# EAGLE design spin_pov_LDO (EAGLE 9.6.2)
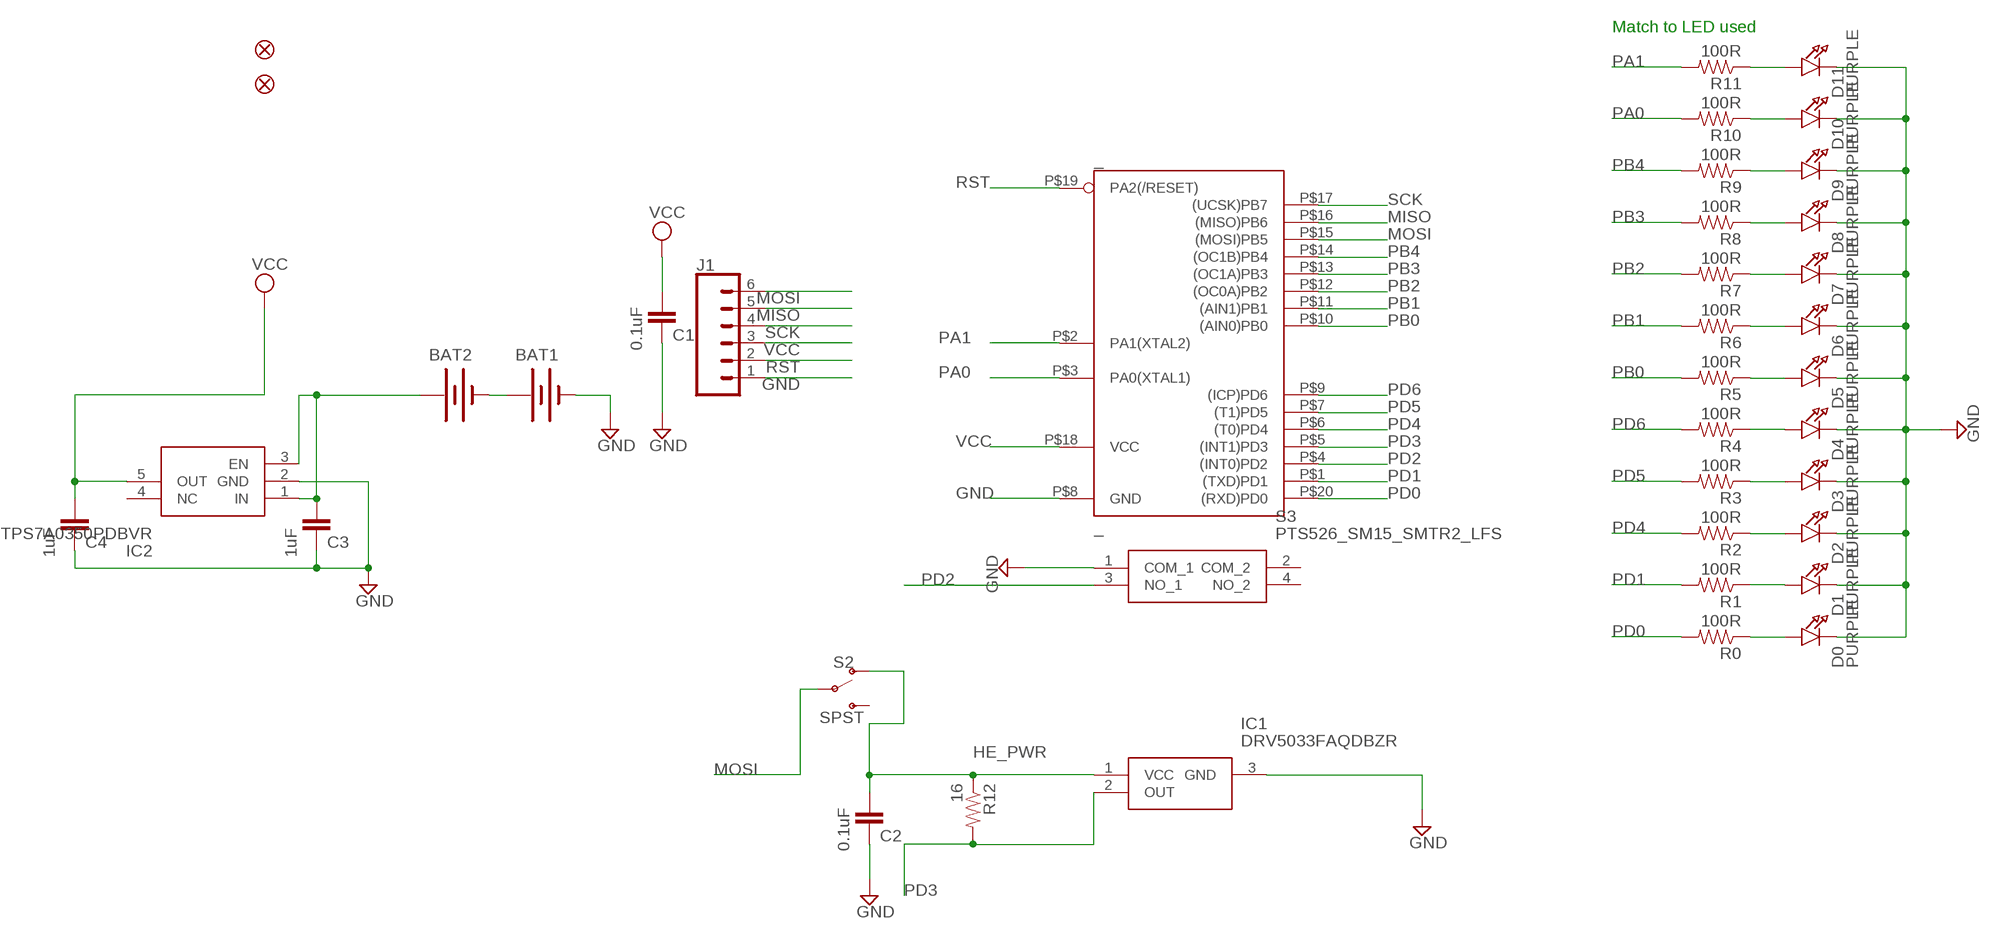
[diagram p0: schematic, sheet 1]

## Parts
_  _  TINY2313-*M*  [MLF20]
AFID1  FIDUCIAL""  [FIDUCIAL_1MM]
AFID2  FIDUCIAL""  [FIDUCIAL_1MM]
BAT1  SPARKFUN_BATTERYSPARKFUN_BATTCOMM_20MM_LINX  [SPARKFUN_BATTCOM_20MM_LINX]
BAT2  SPARKFUN_BATTERYSPARKFUN_BATTCOMM_20MM_LINX  [SPARKFUN_BATTCOM_20MM_LINX]
C1  0.1uF  CAP0805  [0805]
C2  0.1uF  CAP0805  [0805]
C3  1uF  CAP0805  [0805]
C4  1uF  CAP0805  [0805]
D0  PURPLE  LED0805_NOOUTLINE  [CHIPLED_0805_NOOUTLINE]
D1  PURPLE  LED0805_NOOUTLINE  [CHIPLED_0805_NOOUTLINE]
D2  PURPLE  LED0805_NOOUTLINE  [CHIPLED_0805_NOOUTLINE]
D3  PURPLE  LED0805_NOOUTLINE  [CHIPLED_0805_NOOUTLINE]
D4  PURPLE  LED0805_NOOUTLINE  [CHIPLED_0805_NOOUTLINE]
D5  PURPLE  LED0805_NOOUTLINE  [CHIPLED_0805_NOOUTLINE]
D6  PURPLE  LED0805_NOOUTLINE  [CHIPLED_0805_NOOUTLINE]
D7  PURPLE  LED0805_NOOUTLINE  [CHIPLED_0805_NOOUTLINE]
D8  PURPLE  LED0805_NOOUTLINE  [CHIPLED_0805_NOOUTLINE]
D9  PURPLE  LED0805_NOOUTLINE  [CHIPLED_0805_NOOUTLINE]
D10  PURPLE  LED0805_NOOUTLINE  [CHIPLED_0805_NOOUTLINE]
D11  PURPLE  LED0805_NOOUTLINE  [CHIPLED_0805_NOOUTLINE]
IC1  DRV5033FAQDBZR  [SOT95P237X112-3N]
IC2  TPS7A0350PDBVR  [SOT95P280X145-5N]
J1  CONN_06SMD-FEMALE-V2  [1X06-SMD-FEMALE]
R0  100R  RESISTOR  [0805]
R1  100R  RESISTOR  [0805]
R2  100R  RESISTOR  [0805]
R3  100R  RESISTOR  [0805]
R4  100R  RESISTOR  [0805]
R5  100R  RESISTOR  [0805]
R6  100R  RESISTOR  [0805]
R7  100R  RESISTOR  [0805]
R8  100R  RESISTOR  [0805]
R9  100R  RESISTOR  [0805]
R10  100R  RESISTOR  [0805]
R11  100R  RESISTOR  [0805]
R12  16  RESISTOR  [0805]
S2  SPST  SWITCH-SPDT-SMD-RIGHT-ANGLE  [SWITCH_SPST_SMD_A]
S3  PTS526_SM15_SMTR2_LFS  [PTS526SM15SMTR2LFS]

## Nets
GND [power]: _.P$8(GND) BAT1.2(-) C1.2 C2.2 C3.2 C4.2 D0.C D1.C D2.C D3.C D4.C D5.C D6.C D7.C D8.C D9.C D10.C D11.C IC1.3(GND) IC2.2(GND) J1.1 S3.1(COM_1)
HE_PWR: C2.1 IC1.1(VCC) R12.1 S2.1(O)
MISO: _.P$16((MISO)PB6) J1.5
MOSI: _.P$15((MOSI)PB5) J1.6 S2.2(P)
N$1: BAT2.1(+) C3.1 IC2.1(IN) IC2.3(EN)
N$2: BAT1.1(+) BAT2.2(-)
N$8 [leds]: D0.A R0.1
N$9 [leds]: D1.A R1.1
N$10 [leds]: D2.A R2.1
N$11 [leds]: D3.A R3.1
N$12 [leds]: D4.A R4.1
N$13 [leds]: D5.A R5.1
N$14 [leds]: D6.A R6.1
N$15 [leds]: D7.A R7.1
N$16 [leds]: D8.A R8.1
N$21 [leds]: D9.A R9.1
N$23 [leds]: D10.A R10.1
N$25 [leds]: D11.A R11.1
PA0: _.P$3(PA0(XTAL1)) R10.2
PA1: _.P$2(PA1(XTAL2)) R11.2
PB0: _.P$10((AIN0)PB0) R5.2
PB1: _.P$11((AIN1)PB1) R6.2
PB2: _.P$12((OC0A)PB2) R7.2
PB3: _.P$13((OC1A)PB3) R8.2
PB4: _.P$14((OC1B)PB4) R9.2
PD0: _.P$20((RXD)PD0) R0.2
PD1: _.P$1((TXD)PD1) R1.2
PD2: _.P$4((INT0)PD2) S3.3(NO_1)
PD3: _.P$5((INT1)PD3) IC1.2(OUT) R12.2
PD4: _.P$6((T0)PD4) R2.2
PD5: _.P$7((T1)PD5) R3.2
PD6: _.P$9((ICP)PD6) R4.2
RST: _.P$19(PA2(/RESET)) J1.2
SCK: _.P$17((UCSK)PB7) J1.4
VCC [power]: _.P$18(VCC) C1.1 C4.1 IC2.5(OUT) J1.3
Unconnected: IC2.4(NC) S2.3(S) S3.2(COM_2) S3.4(NO_2)

## Notes on the sheet
- Match to LED used

## Library data of the parts
_ = NSL_Cylon:TINY2313*: Atmel Tiny2313 2K Flash, 128 bytes EEPROM, 128 bytes RAM
AFID1 AFID2 = microbuilder:FIDUCIAL: Fiducial Alignment Points Various fiducial points for machine vision alignment.
BAT1 BAT2 = NSL:SPARKFUN_BATTERY: Battery Holders Various common sizes : AA, AAA, 20mm coin cell and 12mm coin cell.
C1-C4 = SparkFun:CAP: Capacitor Standard 0603 ceramic capacitor, and 0.1" leaded capacitor.
D0 D1-D11 = microbuilder:LED: LED 0603 - 0603 Surface Mount Package 2mA: Green LED - Low Power (3.9mcd, 2ma, 1.7Vf) - Digikey: 475-2709-2-ND Orange LED - Low Power (9.8mcd, 2ma, 1.8Vf) - Digikey: 475-1194-2-ND Red LED - Low Power (5mcd, 2ma, 1.8Vf) - Digikey: 475-1195-2-ND Yellow LED - Low Power (7mcd, 2ma, 1.8Vf) - Digikey: 475-1196-2-ND 5mA: Blue LED - Low Power (17mcd, 5ma, 2.9Vf) - Digikey: LNJ937W8CRACT-ND 0805 - 0805 Surface Mount Package 2mA: Red LED (8.8mcd, 2mA, 1.8Vf, Clear) - Low Power [Digikey: 475-2510-1-ND] Green LED (5mcd, 2mA, 1.8Vf, Clear) - Low Power [Digikey: 475-2730-1-ND] Yellow LED (11.3mcd, 2mA, 1.8Vf, Clear) - Low Power [Digikey: 475-2555-1-ND] 20mA: Red LED (104mcd, 20mA, Diffused) - LS R976 [Digikey: 475-1278-6-ND] Red LED (12mcd, 20mA, 2.0Vf, Clear) - APT2012EC [Digikey: 754-1128-1-ND] Green LED (15mcd, 20mA, 2.2Vf, Clear) - APT2012GC [Digikey: 754-1131-1-ND] Orange LED (160mcd, 20mA, 2.1Vf, Clear) - APT2012SECK [Digikey: 754-1130-1-ND] 1206 - 1206 Surface Mount Package Green LED (26mcd, 20mA, Diffused) - LG N971 [Digikey: 475-1407-6-ND] Red LED (15mcd, 20mA, Diffused) - LH N974 [Digikey: 475-1416-6-ND]
IC1 = DRV5033FAQDBZR:DRV5033FAQDBZR: High voltage (up to 38V), high bandwidth (up to 30 kHz) omnipolar switch Source: Datasheet <https://www.ti.com/lit/gpn/DRV5033>; DESCRIPTION: High voltage (up to 38V), high bandwidth (up to 30 kHz) omnipolar switch; HEIGHT: 1.12mm; MANUFACTURER_NAME: Texas Instruments; MANUFACTURER_PART_NUMBER: DRV5033FAQDBZR; MOUSER_PART_NUMBER: 595-DRV5033FAQDBZR; MOUSER_PRICE-STOCK: https://www.mouser.co.uk/ProductDetail/Texas-Instruments/DRV5033FAQDBZR?qs=zEmsApcVOkXhmHhk0NRt%252Bw%3D%3D
IC2 = TPS7A0350PDBVR:TPS7A0350PDBVR: Nanopower Iq, 200 nA, 200 mA, Low Dropout Voltage Regulator With Fast Transient Response Source: Datasheet <https://www.ti.com/lit/ds/symlink/tps7a03.pdf?ts=1624267258880>; DESCRIPTION: Nanopower Iq, 200 nA, 200 mA, Low Dropout Voltage Regulator With Fast Transient Response; HEIGHT: 1.45mm; MANUFACTURER_NAME: Texas Instruments; MANUFACTURER_PART_NUMBER: TPS7A0350PDBVR; MOUSER_PART_NUMBER: 595-TPS7A0350PDBVR; MOUSER_PRICE-STOCK: https://www.mouser.co.uk/ProductDetail/Texas-Instruments/TPS7A0350PDBVR?qs=stqOd1AaK7%2FKWuj9zdeUAw%3D%3D
J1 = SparkFun-Connectors:CONN_06: Multi connection point. Often used as Generic Header-pin footprint for 0.1 inch spaced/style header connections On any of the 0.1 inch spaced packages, you can populate with these: Break Away Headers - Straight <https://www.sparkfun.com/products/116> (PRT-00116) Break Away Male Headers - Right Angle <https://www.sparkfun.com/products/553> (PRT-00553) Female Headers <https://www.sparkfun.com/products/115> (PRT-00115) Break Away Headers - Machine Pin <https://www.sparkfun.com/products/117> (PRT-00117) Break Away Female Headers - Swiss Machine Pin <https://www.sparkfun.com/products/743> (PRT-00743) Arduino Stackable Header - 6 Pin <https://www.sparkfun.com/products/9280> (PRT-09280) Screw Terminals 2.54mm Pitch (6-Pin) <https://www.sparkfun.com/products/16499> (PRT-16499) For SCREWTERMINALS and SPRING TERMINALS visit here: Screw Terimnals on SparkFun.com <https://www.sparkfun.com/search/results?term=Screw+Terminals> (5mm/3.5mm/2.54mm spacing) This device is also useful as a general connection point to wire up your design to another part of your project. Our various solder wires solder well into these plated through hole pads. Hook-Up Wire - Assortment (Stranded, 22 AWG) <https://www.sparkfun.com/products/11375> (PRT-11375) Hook-Up Wire - Assortment (Solid Core, 22 AWG) <https://www.sparkfun.com/products/11367> (PRT-11367) View the entire wire category on our website here <https://www.sparkfun.com/categories/141>; PROD_ID: CONN-09668
R0 = SparkFun:RESISTOR: Resistor Basic schematic elements and footprints for 0603, 1206, and PTH 1/10th watt (small) resistors.; SPICEPREFIX: R
R1-R12 = SparkFun:RESISTOR: Resistor Basic schematic elements and footprints for 0603, 1206, and PTH 1/10th watt (small) resistors.
S2 = SparkFun-Switches:SWITCH-SPDT: Single Pole, Double Throw (SPDT) Switch Single-pole, double-throw (SPDT) switch. Variant Overview SMD-AYZ0202 Surface Mount DPDT Switch <https://www.sparkfun.com/products/597> (COM-00597) Used on e.g. LilyPad Arduino USB - ATmega32U4 Board <https://www.sparkfun.com/products/12049> PTH-11.6X4.0MM SPDT Mini Power Switch <https://www.sparkfun.com/products/102> (COM-00102) Used on e.g. SparkFun Simon Says - Through-Hole Soldering Kit <https://www.sparkfun.com/products/10547> (KIT-10547) PTH-11.6X4.0MM-KIT KIT version of SPDT Mini Power Switch - Simplifies soldering by removing tStop of switch pins - only one side can be soldered. PTH-11.6X4.0MM-LOCK LOCK version of SPDT Mini Power Switch - Offset pins hold switch in place for easier soldering. SMD-RIGHT-ANGLE Surface Mount Right Angle Switch <https://www.sparkfun.com/products/10860> (COM-10860) Used on e.g. SparkFun ESP8266 Thing <https://www.sparkfun.com/products/13231>; PROD_ID: SWCH-10651; SF_SKU: COM-10860
S3 = PTS526_SM15_SMTR2_LFS:PTS526_SM15_SMTR2_LFS: Tactile Switches 50mA 12VDC, 5.2x5.2mm, 1.5mm H, 160gf, G leads, No ground pin, metal actuator Source: Datasheet; DESCRIPTION: Tactile Switches 50mA 12VDC, 5.2x5.2mm, 1.5mm H, 160gf, G leads, No ground pin, metal actuator; HEIGHT: 1.5mm; MANUFACTURER_NAME: C & K COMPONENTS; MANUFACTURER_PART_NUMBER: PTS526 SM15 SMTR2 LFS; MOUSER_PART_NUMBER: 611-PTS526SM15SMTR2L; MOUSER_PRICE-STOCK: https://www.mouser.co.uk/ProductDetail/CK/PTS526-SM15-SMTR2-LFS?qs=UXgszm6BlbENivbslIA%252B5g%3D%3D

## Net classes
0 default: width 0.203 mm
1 power: width 0.203 mm
2 leds: width 0.203 mm

## Board
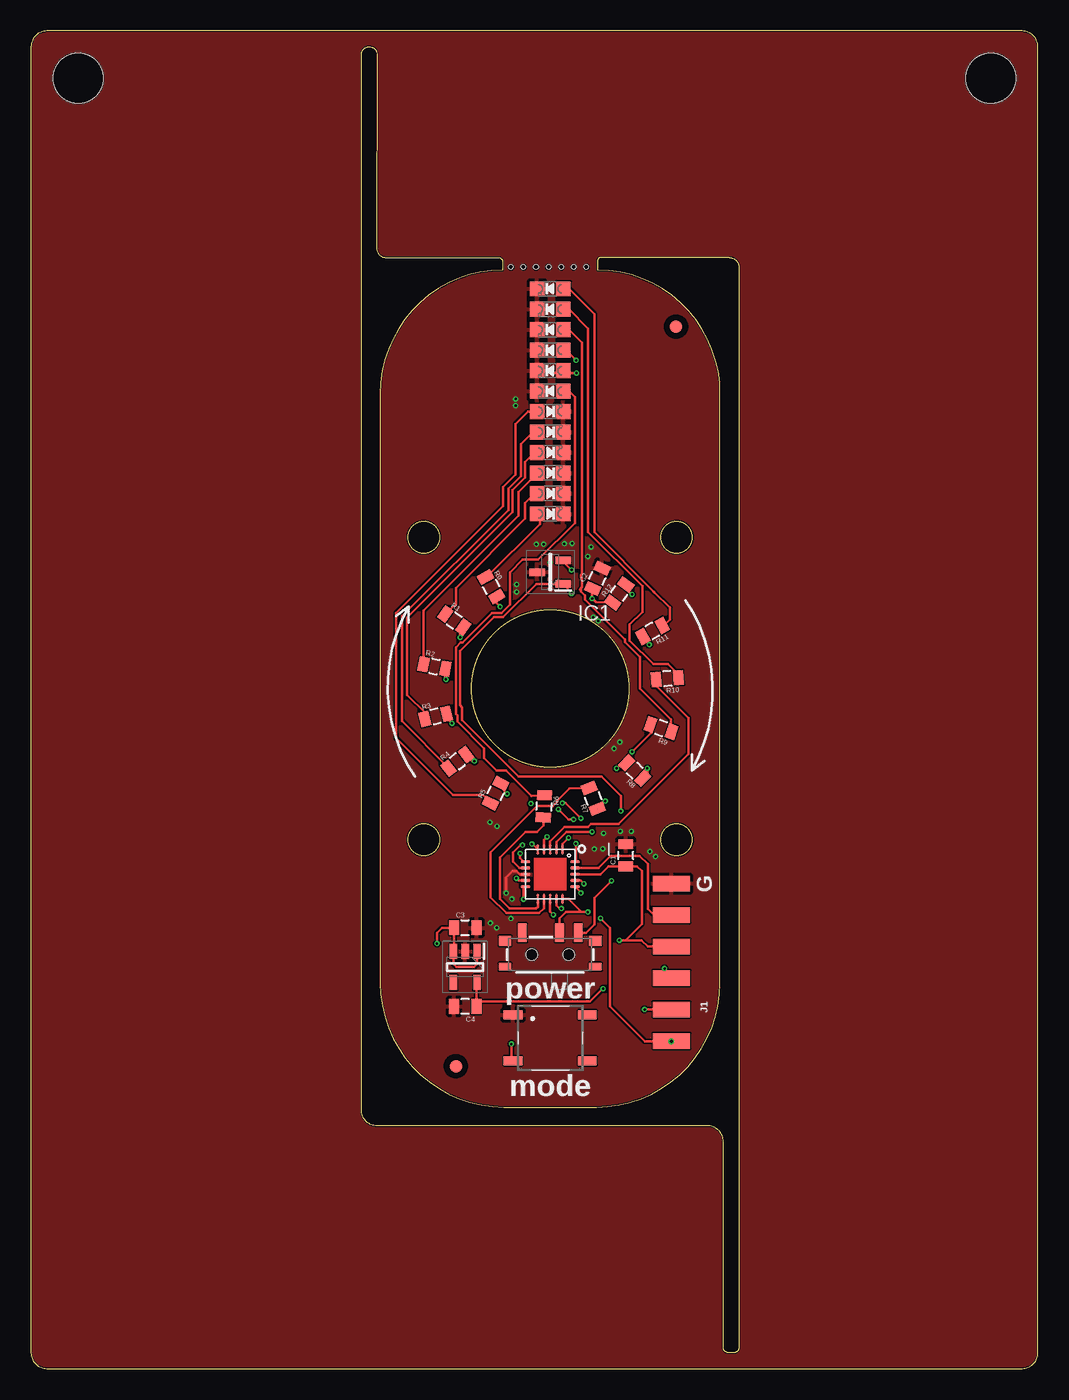
[diagram p1: board, top side]
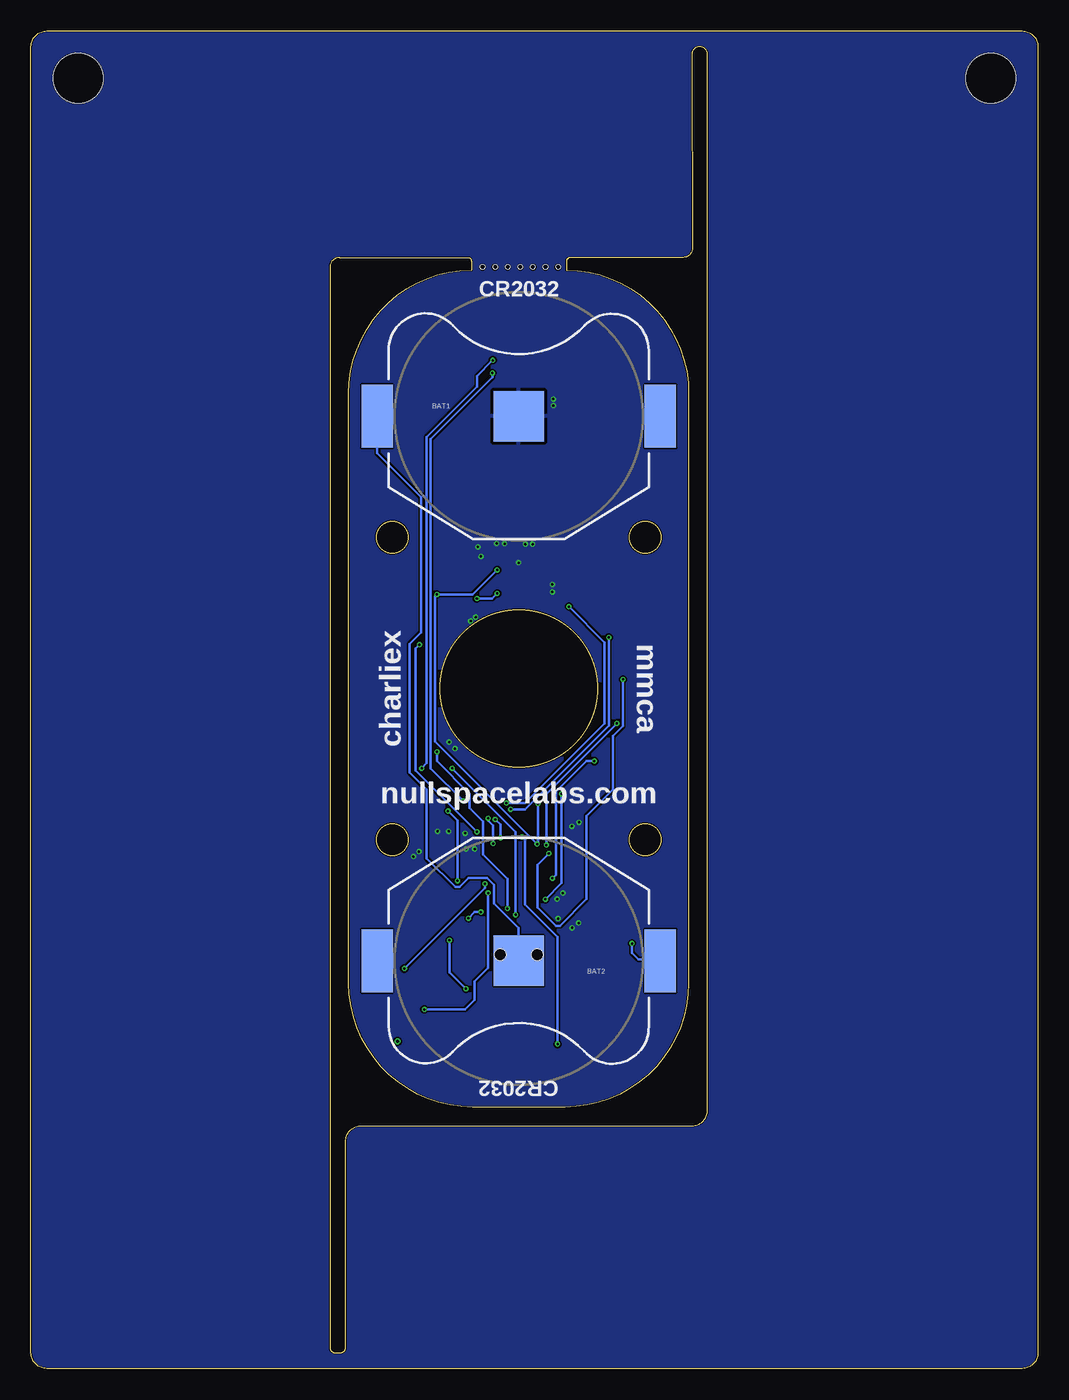
[diagram p2: board, bottom side, seen from below]

Size 81.28 x 107.95 mm. Coordinates in mm from the lower left corner, seen from the top.
Outline: 38.19,21.1 45.63,21.1 arc90 55.63,31.1 55.63,78.65 arc90 45.74,88.66 45.74,89.41 arc-90 45.99,89.66 56.39,89.66 arc-90 57.15,88.9 57.15,1.7 arc-90 56.72,1.27 56.31,1.27 arc-90 55.88,1.7 55.88,18.32 arc90 54.61,19.59 27.94,19.59 arc-90 26.67,20.86 26.67,106.05 arc-90 27.3,106.68 arc-90 27.94,106.05 27.89,90.44 arc90 28.67,89.66 37.74,89.66 arc-90 38.07,89.33 38.07,88.66 arc90 28.19,78.66 28.19,31.1 arc90 38.19,21.1
Outline: 80.01,107.95 1.27,107.95 arc90 0,106.68 0,1.27 arc90 1.27,0 80.01,0 arc90 81.28,1.27 81.28,106.68 arc90 80.01,107.95
Outline: circle at 41.91,54.88 radius 6.35
Outline: circle at 31.71,67.08 radius 1.25
Outline: circle at 52.11,67.08 radius 1.25
Outline: circle at 52.11,42.68 radius 1.25
Outline: circle at 31.71,42.68 radius 1.25
Copper layers (1*16): Top 0.035mm / dielectric 1.5mm / Bottom 0.035mm
Design rules "jlcpcb-2-layer *": minimum track width 3.5mil, minimum drill 0.2mm, track to track 5mil, track to pad 5mil, pad to pad 5mil, via to via 5mil, smd to smd 0mil, copper to edge 0.1mm, drill to drill 5mil, minimum pad ring 4mil, minimum via ring 4mil, stop-mask expansion 3mil, vias tented up to drill 100mil, thermal gap 10mil
Holes 4 mm at 3.81,104.14 77.47,104.14
Holes 0.35 mm at 38.73,88.9 39.75,88.9 40.77,88.9 41.78,88.9 42.8,88.9 43.81,88.9 44.83,88.9

### Footprints (pad centres in the part's own frame; a part is rotated, then mirrored left to right if it is on the bottom)
MLF20 = smd 0.8 x 0.23: P$1 -2,1; P$2 -2,0.5; P$3 -2,0; P$4 -2,-0.5; P$5 -2,-1; P$11 2,-1; P$12 2,-0.5; P$13 2,0; P$14 2,0.5; P$15 2,1 | smd 0.23 x 0.8: P$6 -1,-2; P$7 -0.5,-2; P$8 0,-2; P$9 0.5,-2; P$10 1,-2; P$16 1,2; P$17 0.5,2; P$18 0,2; P$19 -0.5,2; P$20 -1,2
FIDUCIAL_1MM = smd 1 x 1: 1 0,0
SPARKFUN_BATTCOM_20MM_LINX = smd 2.54 x 5.08: 1 -11.43,0; 3 11.43,0 | smd 4.064 x 4.064: 2 0,0
0805 = smd 0.8 x 1.2: 1 -0.9,0; 2 0.9,0
CHIPLED_0805_NOOUTLINE = smd 1.2 x 1.2: A 0,-1.05; C 0,1.05
SOT95P237X112-3N = smd 1.25 x 0.6: 1 -1.05,0.95; 2 -1.05,-0.95; 3 1.05,0
SOT95P280X145-5N = smd 1.2 x 0.6: 1 -1.25,0.95; 2 -1.25,0; 3 -1.25,-0.95; 4 1.25,-0.95; 5 1.25,0.95
1X06-SMD-FEMALE = smd 1.25 x 3: 1 6.35,3.425; 2 3.81,3.425; 3 1.27,3.425; 4 -1.27,3.425; 5 -3.81,3.425; 6 -6.35,3.425
SWITCH_SPST_SMD_A = smd 0.7 x 1.5: 1 -2.25,-1.75; 2 -0.75,-1.75; 3 2.25,-1.75 | smd 1 x 0.6: GND1 -3.65,1; GND3 3.65,1 | smd 1 x 0.8: GND2 -3.65,-1.1; GND4 3.65,-1.1 | hole 0.9: -1.5,0; 1.5,0
PTS526SM15SMTR2LFS = smd 1.5 x 0.7: 1 -3,1.85; 2 3,1.85; 3 -3,-1.85; 4 3,-1.85

### Placement (x,y rotation side)
_  41.91,39.89 270 top
AFID1  52.07,84.09 0 top
AFID2  34.29,24.4 0 top
BAT1  41.91,76.85 0 bottom
BAT2  41.91,32.91 180 bottom
C1  48.01,41.42 90 top
C2  45.72,63.77 65 top
C3  35.05,35.58 0 top
C4  35.05,29.23 180 top
D0  41.91,68.98 270 top
D1  41.91,70.63 270 top
D2  41.91,72.28 270 top
D3  41.91,73.93 270 top
D4  41.91,75.58 270 top
D5  41.91,77.23 270 top
D6  41.91,78.88 90 top
D7  41.91,80.53 90 top
D8  41.91,82.19 90 top
D9  41.91,83.84 90 top
D10  41.91,85.49 90 top
D11  41.91,87.14 90 top
IC1  41.91,64.28 180 top
IC2  35.05,32.4 270 top
J1  55.12,32.78 90 top
R0  37.15,63.08 300 top
R1  34.16,60.37 324.5 top
R2  32.57,56.67 349 top
R3  32.66,52.64 13.5 top
R4  34.41,49.01 38 top
R5  37.51,46.43 62.5 top
R6  41.4,45.37 267 top
R7  45.38,46.02 111.5 top
R8  48.73,48.26 136 top
R9  50.85,51.68 160.5 top
R10  51.36,55.68 185 top
R11  50.17,59.53 209.5 top
R12  47.48,62.54 54 top
S2  41.91,33.42 180 top
S3  41.91,26.69 0 top

### Tracks (layer width: path | path; a pad name or v marks a point on that pad's centre or on a via)
GND  (via drill 0.2)
  Top 0.203: v38.35,38.37 38.35,39.64 38.86,40.15 39.2,40.15 39.46,39.89 _.P$8
  other vias: 45.79,60.33 39.12,78.25 48.46,43.35 46.15,41.95 41.91,65.04 37.59,35.58 45.21,66.31 44.96,65.55 43.05,66.56 49.96,41.72 46.23,43.2 45.47,41.93 38.81,37.89 37.08,35.96 39.19,62.68 39.19,63.29 43.69,66.59 38.73,36.31 37.62,43.75 37.03,44.09 39.12,77.71 50.42,41.32 47.57,43.35 45.38,60.63 41.38,66.54 40.79,66.54 47.52,50.56 47.07,50.03
  pour Top: -2.03,108.2 81.53,108.2 81.53,-2.03 -2.03,-2.03
  pour Bottom: -1.78,109.22 81.28,109.22 81.28,-2.03 -1.78,-2.03
HE_PWR  (via drill 0.2)
  Top 0.203: v47.62,44.99 47.62,46.2 46.05,47.77 39.37,47.77 34.8,52.34 34.8,53.36 34.62,53.53 34.62,57.91 37.36,60.65 38.1,60.65 40.78,63.33 IC1.1 43.64,62.64 v43.64,62.56 | R12.1 45.59,61.85 v45.29,62.14 45.29,62.91 C2.1 | v46.86,39.36 45.47,37.96 45.47,35.83 44.8,35.17 S2.1
  Bottom 0.203: v43.64,62.56 44.06,62.14 v45.29,62.14 | v46.86,39.36 46.86,44.23 v47.62,44.99
MISO  (via drill 0.2)
  Top 0.203: _.P$16 44.39,38.42 v44.39,38.37 | v49.53,28.97 J1.5
  Bottom 0.203: v49.53,28.97 46.23,28.97 45.47,29.73 45.47,31.26 44.39,32.34 v44.39,38.37
MOSI  (via drill 0.2, 0.25)
  Top 0.203: J1.6 v51.69,26.41 49.55,26.41 46.74,29.23 46.74,35.58 v45.97,36.34 | _.P$15 43.4,37.89 44.45,36.85 v44.96,36.85 43.18,36.85 42.66,36.33 S2.2
  Bottom 0.203: v44.96,36.85 45.47,36.85 v45.97,36.34
N$1  (via drill 0.2)
  Top 0.203: IC2.1 36,32.66 35.76,32.43 34.34,32.43 34.1,32.66 IC2.3 34.15,33.7 C3.1 33.2,35.58 32.77,35.14 v32.77,34.31
  Bottom 0.203: BAT2.1 30.61,33.04 32.26,33.04 32.77,33.54 v32.77,34.31
N$2
  Bottom 0.203: BAT2.2 41.91,35.56 43.89,37.55 43.89,39.03 44.47,39.61 45.95,39.61 46.7,38.86 47.03,38.86 49.34,41.18 49.34,46.75 50.7,48.11 50.7,58.48 49.78,59.4 49.78,70.32 53.34,73.88 BAT1.1
N$8
  Top 0.203: R0.1 36.73,63.82 41.07,68.16 41.07,68.89 D0.A
N$9
  Top 0.203: D1.A 40.64,70.63 39.88,69.87 39.88,68.6 34.29,63.01 34.29,61.68 R1.1
N$10
  Top 0.203: D2.A 40.86,72.25 39.37,70.75 39.37,68.85 31.69,61.17 R2.1
N$11
  Top 0.203: D3.A 40.64,73.93 39.88,73.17 39.88,71.9 38.86,70.88 38.86,69.1 30.35,60.59 30.35,54.37 31.83,52.89 R3.1
N$12
  Top 0.203: D4.A 40.51,75.58 39.55,74.62 39.55,72.03 38.53,71.02 38.53,69.28 29.97,60.72 29.97,52.25 R4.1
N$13  (1 unrouted)
  Top 0.203: D5.A 40.13,77.23 39.12,76.22 39.12,72.15 38.1,71.14 38.1,69.61 29.46,60.98 29.46,50.9 34.07,46.3 36.5,46.3 R5.1
N$14
  Top 0.203: R6.1 40.41,46.22 38.35,48.28 37.59,48.28 36.58,49.29 36.58,50.05 34.41,52.21 34.41,52.7 34.29,52.83 34.29,58.18 34.68,58.58 34.82,58.58 37.22,60.98 37.96,60.98 38.65,61.66 38.65,64.25 39.68,65.28 40.92,65.28 43.89,68.25 43.89,78.41 43.41,78.88 D6.A
N$15  (via drill 0.2)  (1 unrouted)
  Top 0.203: v46.37,45.8 45.79,45.23 R7.1 | v44.03,80.34 42.25,80.34 D7.A
  Bottom 0.203: v44.03,80.34 44.03,80 49.01,75.02 49.01,48.44 v46.37,45.8
N$16  (via drill 0.2)
  Top 0.203: v49.75,48.44 49.75,48.07 R8.1 | v44.01,81.38 43.2,82.19 D8.A
  Bottom 0.203: v44.01,81.38 45.27,80.11 45.27,79.25 49.34,75.19 49.34,48.85 v49.75,48.44
N$21
  Top 0.203: R9.1 51.65,52.4 49.17,54.88 49.17,57.42 47.96,58.63 47.96,58.82 44.72,62.06 44.72,62.39 44.39,62.72 44.39,62.8 44.3,62.89 44.47,63.05 44.47,63.8 44.39,63.88 44.39,64.04 44.47,64.13 44.47,82.78 43.41,83.84 D9.A
N$23
  Top 0.203: R10.1 52.21,56.05 51.4,56.86 50.23,56.86 48.32,58.77 48.32,60.04 49.34,61.06 49.34,63.13 44.96,67.52 44.96,83.94 43.41,85.49 D10.A
N$25
  Top 0.203: D11.A 43.43,87.14 45.47,85.11 45.47,67.5 50.25,62.72 50.33,62.64 51.56,61.41 51.56,60.47 51.04,59.95 R11.1
PA0
  Top 0.203: _.P$3 41.91,42.56 43.06,43.7 44.96,43.7 45.21,43.96 47.41,43.96 53.05,49.6 53.05,52.49 50.52,55.02 R10.2
PA1  (via drill 0.2)
  Top 0.203: v45.29,43.32 43.23,43.32 42.41,42.5 _.P$2 | v49.92,58.43 49.43,58.92 R11.2
  Bottom 0.203: v45.29,43.32 50.25,48.28 50.25,58.1 v49.92,58.43
PB0  (via drill 0.2)
  Top 0.203: v39.76,37.86 39.76,38.75 _.P$10 | v38.44,46.38 37.9,46.92 R5.2
  Bottom 0.203: v39.76,37.86 38.44,39.18 v38.44,46.38
PB1
  Top 0.203: _.P$11 40.91,37.26 40.78,37.13 38.61,37.13 37.85,37.89 37.85,41.26 39.91,43.32 40.84,43.32 41.36,43.84 R6.2
PB2
  Top 0.203: _.P$12 41.41,37.14 41.02,36.75 38.37,36.75 37.09,38.03 37.09,41.64 40.84,45.39 42.11,45.39 42.11,45.38 42.47,45.74 42.47,45.81 43.46,46.81 R7.2
PB3  (via drill 0.2)
  Top 0.203: v42.16,36.62 41.91,36.87 _.P$13 | v47.28,48.44 47.68,48.85 R8.2
  Bottom 0.203: v42.16,36.62 42.16,43.32 v47.28,48.44
PB4  (via drill 0.2)
  Top 0.203: _.P$14 42.41,37.36 42.64,37.13 v42.82,37.13 | v48.51,49.76 50.05,51.3 R9.2
  Bottom 0.203: v42.82,37.13 42.82,39.53 44.8,41.51 44.8,44.15 45.87,45.22 45.87,46.38 48.51,49.02 v48.51,49.76
PD0  (via drill 0.2)
  Top 0.203: v44.39,44.4 43.15,45.63 v42.9,45.63 | v43.97,42.36 43.97,40.96 _.P$20 | v37.86,61.48 37.57,61.77 R0.2
  Bottom 0.203: v43.97,42.36 43.97,43.82 44.39,44.23 v44.39,44.4 | v42.9,45.63 41.41,45.63 34.98,52.07 34.98,58.59 v37.86,61.48
PD1  (via drill 0.2)
  Top 0.203: v43.81,44.31 43.4,44.31 v42.57,45.14 | v43.4,42.84 42.91,42.35 _.P$1 | v34.65,59.01 34.65,59.67 R1.2
  Bottom 0.203: v43.81,44.31 43.4,43.9 v43.4,42.84 | v42.57,45.14 41.41,45.14 34.65,51.91 v34.65,59.01
PD2  (via drill 0.2)
  Top 0.203: _.P$4 41.41,42.66 v41.66,42.92 | v38.78,26.18 38.78,24.97 S3.3
  Bottom 0.203: v41.66,42.92 41.41,42.66 41.41,37.46 38.78,34.83 v38.78,26.18
PD3  (via drill 0.2)
  Top 0.203: v40.42,42.33 40.47,42.33 _.P$5 | v48.51,62.47 47.98,63.01 R12.2 | v43.64,64.46 42.96,65.14 IC1.2
  Bottom 0.203: v43.64,64.46 45.62,62.47 v48.51,62.47 48.68,62.31 48.68,50.59 v40.42,42.33 40.36,42.4 v40.36,45.59
PD4  (via drill 0.2)
  Top 0.203: v39.48,41.57 39.48,41.22 39.81,40.89 _.P$6 | v33.49,55.62 33.41,55.7 R2.2
  Bottom 0.203: v33.49,55.62 33.49,51.86 34.29,51.06 34.29,46.73 36.42,44.59 36.42,37.89 38.58,35.73 38.91,35.73 40.39,37.2 40.39,40.66 v39.48,41.57
PD5  (via drill 0.2)
  Top 0.203: _.P$7 39.42,40.39 38.91,40.91 38.91,41.65 39.52,42.25 v39.67,42.25 | v33.98,52.07 33.49,52.57 R3.2
  Bottom 0.203: v39.67,42.25 39.67,46.38 v33.98,52.07
PD6  (via drill 0.2)
  Top 0.203: _.P$9 39.35,39.39 v39.19,39.56 | v35.8,49.02 35.59,49.02 R4.2
  Bottom 0.203: v39.19,39.56 38.91,39.84 38.91,46.57 36.46,49.02 v35.8,49.02
RST
  Top 0.203: J1.2 50.29,36.59 49.78,37.1 49.78,40.71 49.12,41.37 46.76,41.37 45.79,40.39 _.P$19
SCK  (via drill 0.2)
  Top 0.203: v51.14,32.27 51.69,31.72 J1.4 | _.P$17 44.35,39.39 v44.63,39.11
  Bottom 0.203: v44.63,39.11 44.63,38.78 v51.14,32.27
VCC  (via drill 0.2)
  Top 0.203: _.P$18 45.97,39.89 46.6,40.52 C1.1 48.93,40.52 49.3,40.15 49.3,35.88 47.98,34.56 v47.5,34.56 49.28,34.56 49.78,34.05 J1.3 | IC2.5 35.95,31.1 C4.1 36.36,29.63 45.11,29.63 46.15,30.67 v46.18,30.65
  Bottom 0.203: v46.18,30.65 47.5,31.97 v47.5,34.56

### Text on the board
tPlace: G | power | mode
bPlace: CR2032 | mmca | charliex | nullspacelabs.com | CR2032
tStop: 2024 | LAYERONE
_tNames: D11 | D11 | D10 | D10 | D9 | D9 | D8 | D8 | D7 | D7 | D6 | D6 | D5 | D5 | D4 | D4 | D3 | D3 | D2 | D2 | D1 | D1 | D0 | D0 | R0 | R0 | C2 | C2 | R12 | R12 | R1 | R1 | IC1 | IC1 | R11 | R11 | R2 | R2 | R10 | R10 | R3 | R3 | R9 | R9 | R4 | R4 | R8 | R8 | R5 | R5 | R6 | R6 | R7 | R7 | _ | _ | C1 | C1 | C3 | C3 | S2 | S2 | IC2 | IC2 | C4 | C4 | J1 | J1 | S3 | S3
_bNames: BAT1 | BAT1 | BAT2 | BAT2
_tValues: _ | _